# Altium schematic sheet bmsMaster_usb.SchDoc
size A; SheetNumber: 4; SheetTotal: 6
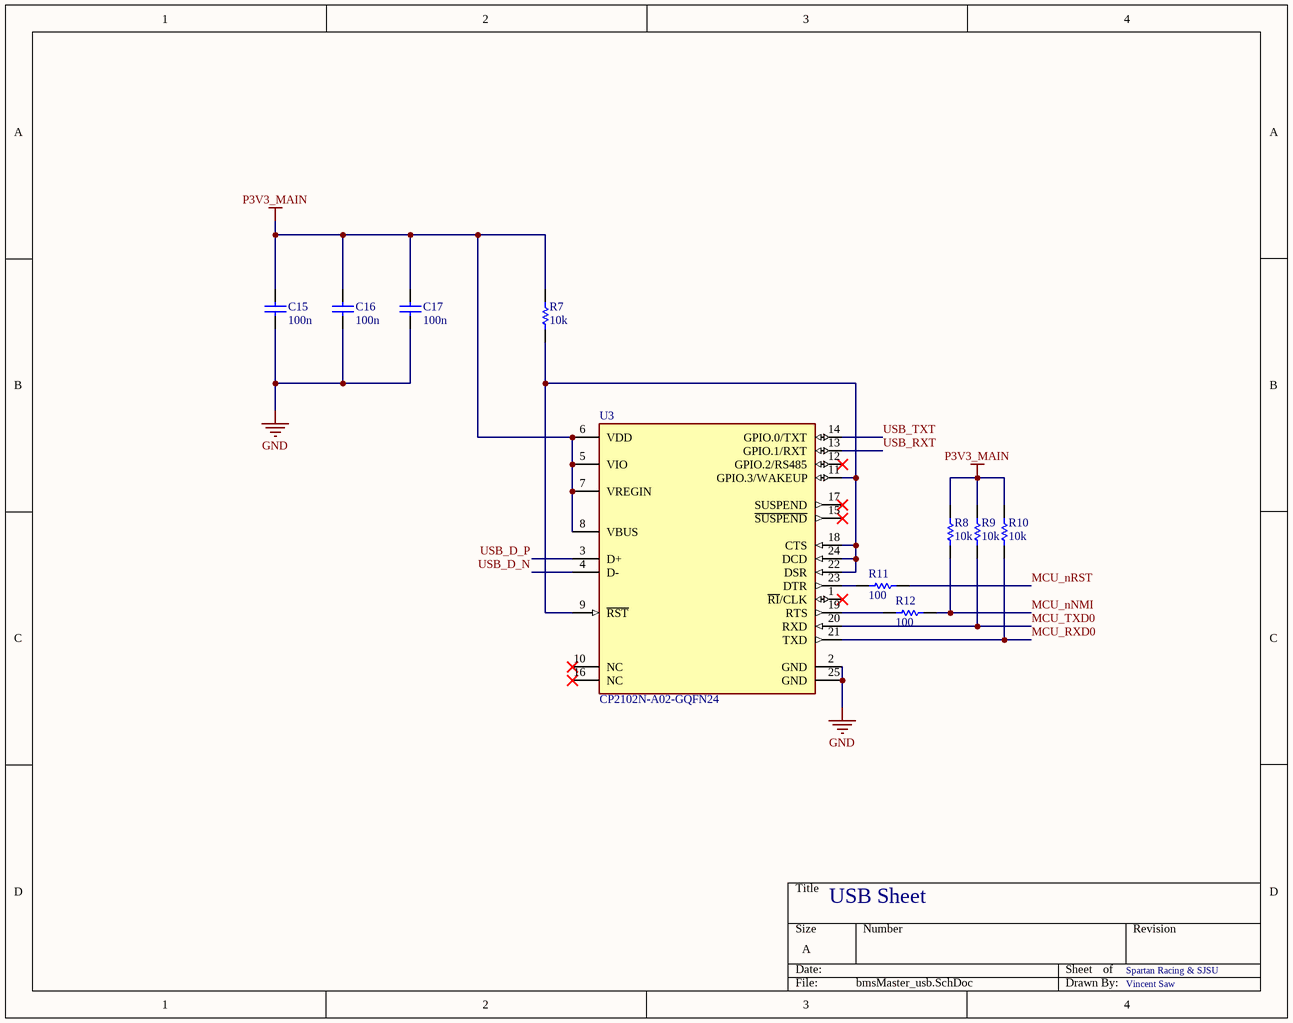
[diagram p0: bmsMaster_usb.SchDoc]

## Parts
C15  value 100n  (hidden comment: Capacitor)
C16  value 100n  (hidden comment: Capacitor)
C17  value 100n  (hidden comment: Capacitor)
R7  value 10k  (hidden comment: Resistor)
R8  value 10k  (hidden comment: Resistor)
R9  value 10k  (hidden comment: Resistor)
R10  value 10k  (hidden comment: Resistor)
R11  value 100  (hidden comment: Resistor)
R12  value 100  (hidden comment: Resistor)
U3  CP2102N-A02-GQFN24  [FP-CP2102N-A02-GQFN24-MFG]

## Nets
GND: C15.1 C16.1 C17.1 U3.2(GND) U3.25(GND)
P3V3_MAIN: C15.2 C16.2 C17.2 R7.2 R8.2 R9.2 R10.2 U3.5(VIO) U3.6(VDD) U3.7(VREGIN) U3.8(VBUS)
MCU_nNMI: R8.1 R12.1
MCU_nRST: R11.1
MCU_RXD0: R10.1 U3.21(TXD)
MCU_TXD0: R9.1 U3.20(RXD)
USB_D_N: U3.4(D-)
USB_D_P: U3.3(D+)
USB_RXT: U3.13(GPIO.1/RXT)
USB_TXT: U3.14(GPIO.0/TXT)
NetR7_1: R7.1 U3.9(~{RST}) U3.11(GPIO.3/WAKEUP) U3.18(CTS) U3.22(DSR) U3.24(DCD)
NetR11_2: R11.2 U3.23(DTR)
NetR12_2: R12.2 U3.19(RTS)

Not connected (* = marked no-connect by the designer): U3 1(~{RI}/CLK)* 10(NC)* 12(GPIO.2/RS485)* 15(~{SUSPEND})* 16(NC)* 17(SUSPEND)*

## Notes on the sheet
- USB Sheet
- Spartan Racing & SJSU
- Vincent Saw

## Library data of the parts
C15-C17 = Capacitor: SimulationGenericComponent: True
R7-R12 = Resistor: TC1: 0; SimulationGenericComponent: True; TC2: 0
U3 = CMP-08107-000010-1: IC USB TO UART BRIDGE QFN24